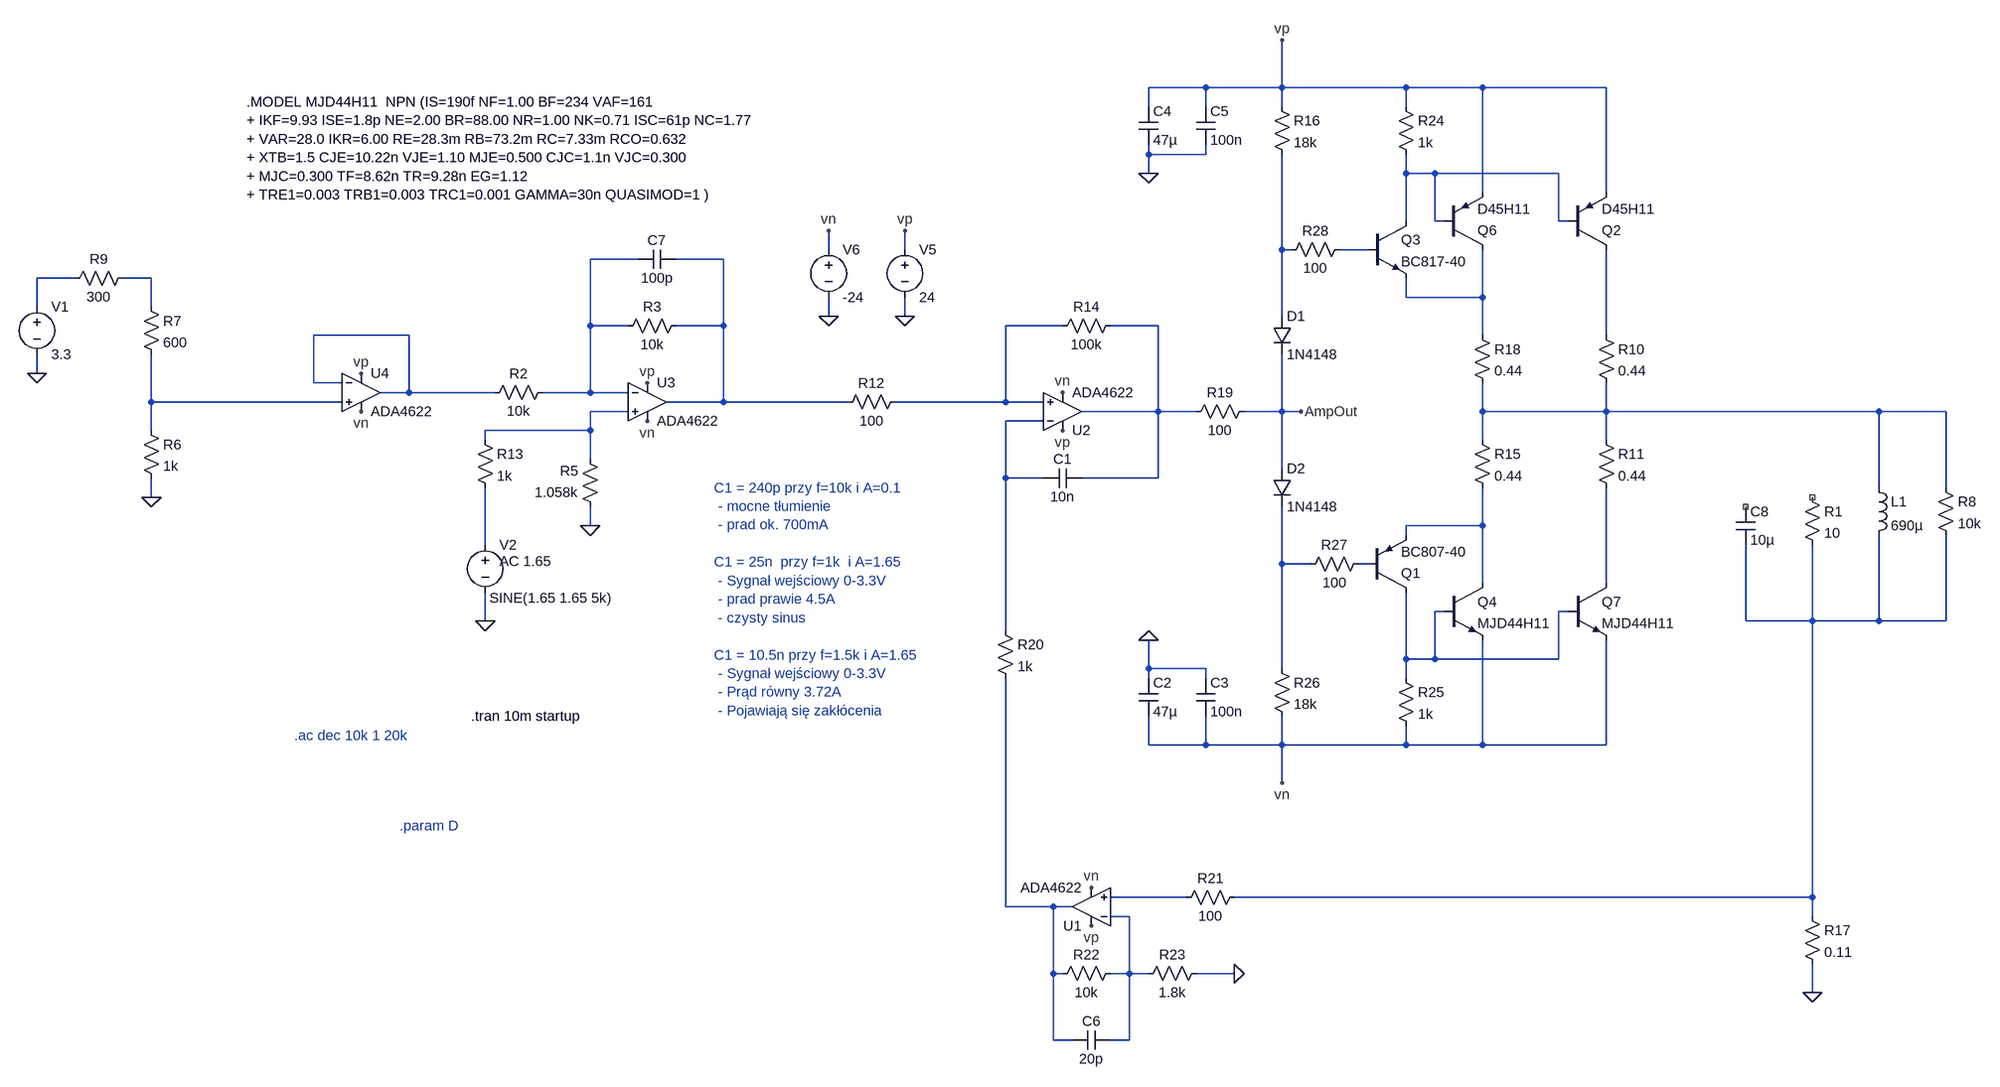
[diagram p0: schematic Shutter.asc]
Shutter.asc, the LTspice schematic file:
Version 4.1
SHEET 1 3148 1552
WIRE 1392 -400 1296 -400
WIRE 1520 -400 1520 -480
WIRE 1520 -400 1392 -400
WIRE 1728 -400 1520 -400
WIRE 1856 -400 1728 -400
WIRE 2064 -400 1856 -400
WIRE 1296 -368 1296 -400
WIRE 1392 -368 1392 -400
WIRE 1520 -368 1520 -400
WIRE 1728 -368 1728 -400
WIRE 1296 -288 1296 -304
WIRE 1392 -288 1392 -304
WIRE 1392 -288 1296 -288
WIRE 1296 -256 1296 -288
WIRE 1728 -256 1728 -288
WIRE 1776 -256 1728 -256
WIRE 1984 -256 1776 -256
WIRE 1856 -224 1856 -400
WIRE 2064 -224 2064 -400
WIRE 1728 -176 1728 -256
WIRE 1776 -176 1776 -256
WIRE 1792 -176 1776 -176
WIRE 1984 -176 1984 -256
WIRE 2000 -176 1984 -176
WIRE 736 -128 736 -160
WIRE 864 -128 864 -160
WIRE 1520 -128 1520 -288
WIRE 1536 -128 1520 -128
WIRE 1664 -128 1616 -128
WIRE 416 -112 336 -112
WIRE 560 -112 480 -112
WIRE -528 -80 -592 -80
WIRE -400 -80 -448 -80
WIRE 1728 -48 1728 -80
WIRE 1856 -48 1856 -128
WIRE 1856 -48 1728 -48
WIRE -592 -32 -592 -80
WIRE -400 -32 -400 -80
WIRE 736 -16 736 -48
WIRE 864 -16 864 -48
WIRE 1520 -16 1520 -128
WIRE 336 0 336 -112
WIRE 400 0 336 0
WIRE 560 0 560 -112
WIRE 560 0 480 0
WIRE 1152 0 1056 0
WIRE 1312 0 1232 0
WIRE 32 16 -128 16
WIRE 1856 16 1856 -48
WIRE 2064 16 2064 -128
WIRE -592 80 -592 48
WIRE -128 96 -128 16
WIRE -80 96 -128 96
WIRE 32 112 32 16
WIRE 32 112 -16 112
WIRE 176 112 32 112
WIRE 336 112 336 0
WIRE 336 112 256 112
WIRE 400 112 336 112
WIRE -400 128 -400 48
WIRE -80 128 -400 128
WIRE 560 128 560 0
WIRE 560 128 464 128
WIRE 768 128 560 128
WIRE 1056 128 1056 0
WIRE 1056 128 848 128
WIRE 1120 128 1056 128
WIRE 400 144 336 144
WIRE 1312 144 1312 0
WIRE 1312 144 1184 144
WIRE 1376 144 1312 144
WIRE 1520 144 1520 48
WIRE 1520 144 1456 144
WIRE 1552 144 1520 144
WIRE 1856 144 1856 96
WIRE 2064 144 2064 96
WIRE 2064 144 1856 144
WIRE 2720 144 2064 144
WIRE 2832 144 2720 144
WIRE 1120 160 1056 160
WIRE -400 176 -400 128
WIRE 336 176 336 144
WIRE 336 176 160 176
WIRE 160 192 160 176
WIRE 1856 192 1856 144
WIRE 2064 192 2064 144
WIRE 336 224 336 176
WIRE 1520 240 1520 144
WIRE 1056 256 1056 160
WIRE 1120 256 1056 256
WIRE 1312 256 1312 144
WIRE 1312 256 1184 256
WIRE 2720 272 2720 144
WIRE 2832 272 2832 144
WIRE -400 288 -400 256
WIRE 336 336 336 304
WIRE 1856 336 1856 272
WIRE 1856 336 1728 336
WIRE 1728 352 1728 336
WIRE 160 368 160 272
WIRE 1520 400 1520 304
WIRE 1568 400 1520 400
WIRE 1664 400 1648 400
WIRE 1856 432 1856 336
WIRE 2064 432 2064 272
WIRE 1792 480 1776 480
WIRE 2000 480 1984 480
WIRE 160 496 160 448
WIRE 2496 496 2496 368
WIRE 2608 496 2608 368
WIRE 2608 496 2496 496
WIRE 2720 496 2720 352
WIRE 2720 496 2608 496
WIRE 2832 496 2832 352
WIRE 2832 496 2720 496
WIRE 1056 512 1056 256
WIRE 1728 560 1728 448
WIRE 1776 560 1776 480
WIRE 1776 560 1728 560
WIRE 1984 560 1984 480
WIRE 1984 560 1776 560
WIRE 1296 576 1296 528
WIRE 1392 576 1296 576
WIRE 1520 576 1520 400
WIRE 1296 592 1296 576
WIRE 1392 592 1392 576
WIRE 1728 592 1728 560
WIRE 1296 704 1296 656
WIRE 1392 704 1392 656
WIRE 1392 704 1296 704
WIRE 1520 704 1520 656
WIRE 1520 704 1392 704
WIRE 1728 704 1728 672
WIRE 1728 704 1520 704
WIRE 1856 704 1856 528
WIRE 1856 704 1728 704
WIRE 2064 704 2064 528
WIRE 2064 704 1856 704
WIRE 1520 768 1520 704
WIRE 1360 960 1232 960
WIRE 2608 960 2608 496
WIRE 2608 960 1440 960
WIRE 1056 976 1056 592
WIRE 1136 976 1056 976
WIRE 1168 976 1136 976
WIRE 1264 992 1232 992
WIRE 2608 992 2608 960
WIRE 1136 1088 1136 976
WIRE 1152 1088 1136 1088
WIRE 1264 1088 1264 992
WIRE 1264 1088 1232 1088
WIRE 1296 1088 1264 1088
WIRE 1440 1088 1376 1088
WIRE 2608 1120 2608 1072
WIRE 1136 1200 1136 1088
WIRE 1168 1200 1136 1200
WIRE 1264 1200 1264 1088
WIRE 1264 1200 1232 1200
FLAG 864 -160 vp
FLAG 1296 528 0
FLAG 1296 -256 0
FLAG 2608 1120 0
FLAG 736 -160 vn
FLAG 864 -16 0
FLAG 736 -16 0
FLAG 1152 112 vn
FLAG 1152 176 vp
FLAG 1200 944 vn
FLAG 1200 1008 vp
FLAG 1520 -480 vp
FLAG 1520 768 vn
FLAG 432 160 vn
FLAG 432 96 vp
FLAG 160 496 0
FLAG -400 288 0
FLAG -592 80 0
FLAG 1552 144 AmpOut
FLAG 1440 1088 0
FLAG 336 336 0
FLAG -48 144 vn
FLAG -48 80 vp
SYMBOL voltage 864 -144 R0
WINDOW 123 0 0 Left 0
WINDOW 39 0 0 Left 0
SYMATTR InstName V5
SYMATTR Value 24
SYMBOL voltage 736 -144 R0
WINDOW 123 0 0 Left 0
WINDOW 39 0 0 Left 0
SYMATTR InstName V6
SYMATTR Value -24
SYMBOL res 1248 -16 R90
WINDOW 0 0 56 VBottom 2
WINDOW 3 32 56 VTop 2
SYMATTR InstName R14
SYMATTR Value 100k
SYMBOL cap 1184 240 R90
WINDOW 0 0 32 VBottom 2
WINDOW 3 32 32 VTop 2
SYMATTR InstName C1
SYMATTR Value 10n
SYMBOL res 1840 176 R0
SYMATTR InstName R15
SYMATTR Value 0.44
SYMBOL cap 1280 592 R0
SYMATTR InstName C2
SYMATTR Value 47µ
SYMBOL cap 1376 592 R0
SYMATTR InstName C3
SYMATTR Value 100n
SYMBOL cap 1280 -368 R0
SYMATTR InstName C4
SYMATTR Value 47µ
SYMBOL cap 1376 -368 R0
SYMATTR InstName C5
SYMATTR Value 100n
SYMBOL res 1504 -384 R0
SYMATTR InstName R16
SYMATTR Value 18k
SYMBOL res 2592 976 R0
SYMATTR InstName R17
SYMATTR Value 0.11
SYMBOL res 1840 0 R0
SYMATTR InstName R18
SYMATTR Value 0.44
SYMBOL diode 1504 -16 R0
SYMATTR InstName D1
SYMATTR Value 1N4148
SYMBOL res 1472 128 R90
WINDOW 0 0 56 VBottom 2
WINDOW 3 32 56 VTop 2
SYMATTR InstName R19
SYMATTR Value 100
SYMBOL res 1040 496 R0
SYMATTR InstName R20
SYMATTR Value 1k
SYMBOL res 1456 944 R90
WINDOW 0 0 56 VBottom 2
WINDOW 3 32 56 VTop 2
SYMATTR InstName R21
SYMATTR Value 100
SYMBOL res 1248 1072 R90
WINDOW 0 0 56 VBottom 2
WINDOW 3 32 56 VTop 2
SYMATTR InstName R22
SYMATTR Value 10k
SYMBOL res 1392 1072 R90
WINDOW 0 0 56 VBottom 2
WINDOW 3 32 56 VTop 2
SYMATTR InstName R23
SYMATTR Value 1.8k
SYMBOL diode 1504 240 R0
SYMATTR InstName D2
SYMATTR Value 1N4148
SYMBOL npn 1664 -176 R0
SYMATTR InstName Q3
SYMATTR Value BC817-40
SYMBOL res 1712 -384 R0
SYMATTR InstName R24
SYMATTR Value 1k
SYMBOL res 1712 576 R0
SYMATTR InstName R25
SYMATTR Value 1k
SYMBOL res 1504 560 R0
SYMATTR InstName R26
SYMATTR Value 18k
SYMBOL res 1664 384 R90
WINDOW 0 0 56 VBottom 2
WINDOW 3 32 56 VTop 2
SYMATTR InstName R27
SYMATTR Value 100
SYMBOL res 1632 -144 R90
WINDOW 0 0 56 VBottom 2
WINDOW 3 32 56 VTop 2
SYMATTR InstName R28
SYMATTR Value 100
SYMBOL voltage 160 352 R0
WINDOW 123 24 44 Left 2
WINDOW 39 0 0 Left 0
WINDOW 3 7 105 Left 2
SYMATTR Value2 AC 1.65
SYMATTR Value SINE(1.65 1.65 5k)
SYMATTR InstName V2
SYMBOL res 496 -16 R90
WINDOW 0 0 56 VBottom 2
WINDOW 3 32 56 VTop 2
SYMATTR InstName R3
SYMATTR Value 10k
SYMBOL res 272 96 R90
WINDOW 0 0 56 VBottom 2
WINDOW 3 32 56 VTop 2
SYMATTR InstName R2
SYMATTR Value 10k
SYMBOL res -416 160 R0
SYMATTR InstName R6
SYMATTR Value 1k
SYMBOL res -416 -48 R0
SYMATTR InstName R7
SYMATTR Value 600
SYMBOL voltage -592 -48 R0
WINDOW 123 0 0 Left 0
WINDOW 39 0 0 Left 0
SYMATTR InstName V1
SYMATTR Value 3.3
SYMBOL cap 480 -128 R90
WINDOW 0 0 32 VBottom 2
WINDOW 3 32 32 VTop 2
SYMATTR InstName C7
SYMATTR Value 100p
SYMBOL res -432 -96 R90
WINDOW 0 0 56 VBottom 2
WINDOW 3 32 56 VTop 2
SYMATTR InstName R9
SYMATTR Value 300
SYMBOL cap 1232 1184 R90
WINDOW 0 0 32 VBottom 2
WINDOW 3 32 32 VTop 2
SYMATTR InstName C6
SYMATTR Value 20p
SYMBOL res 2816 256 R0
SYMATTR InstName R8
SYMATTR Value 10k
SYMBOL ind 2704 256 R0
SYMATTR InstName L1
SYMATTR Value 690µ
SYMATTR SpiceLine Ipk=4 Rser=2
SYMBOL res 352 320 R180
WINDOW 0 36 76 Left 2
WINDOW 3 36 40 Left 2
SYMATTR InstName R5
SYMATTR Value 1.058k
SYMBOL Opamps\\ADA4622 1200 1040 R180
SYMATTR InstName U1
SYMBOL Opamps\\ADA4622 1152 208 M180
SYMATTR InstName U2
SYMBOL Opamps\\ADA4622 432 64 R0
SYMATTR InstName U3
SYMBOL pnp 1792 -128 M180
SYMATTR InstName Q6
SYMATTR Value D45H11
SYMBOL pnp 1664 448 M180
SYMATTR InstName Q1
SYMATTR Value BC807-40
SYMBOL pnp 2000 -128 M180
SYMATTR InstName Q2
SYMATTR Value D45H11
SYMBOL res 2048 0 R0
SYMATTR InstName R10
SYMATTR Value 0.44
SYMBOL res 2048 176 R0
SYMATTR InstName R11
SYMATTR Value 0.44
SYMBOL res 144 176 R0
SYMATTR InstName R13
SYMATTR Value 1k
SYMBOL res 864 112 R90
WINDOW 0 0 56 VBottom 2
WINDOW 3 32 56 VTop 2
SYMATTR InstName R12
SYMATTR Value 100
SYMBOL npn 2000 432 R0
SYMATTR InstName Q7
SYMATTR Value MJD44H11
SYMBOL npn 1792 432 R0
SYMATTR InstName Q4
SYMATTR Value MJD44H11
SYMBOL res 2592 272 R0
SYMATTR InstName R1
SYMATTR Value 10
SYMBOL cap 2480 304 R0
SYMATTR InstName C8
SYMATTR Value 10µ
SYMBOL Opamps\\ADA4622 -48 48 R0
SYMATTR InstName U4
TEXT 136 656 Left 2 !.tran 10m startup
TEXT 16 840 Left 2 ;.param D
TEXT 544 272 Left 2 ;C1 = 240p przy f=10k i A=0.1\n - mocne tłumienie\n - prad ok. 700mA\n \nC1 = 25n  przy f=1k  i A=1.65\n - Sygnał wejściowy 0-3.3V \n - prad prawie 4.5A\n - czysty sinus\n \nC1 = 10.5n przy f=1.5k i A=1.65\n - Sygnał wejściowy 0-3.3V\n - Prąd równy 3.72A\n - Pojawiają się zakłócenia
TEXT -240 -376 Left 2 !.MODEL MJD44H11  NPN (IS=190f NF=1.00 BF=234 VAF=161\n+ IKF=9.93 ISE=1.8p NE=2.00 BR=88.00 NR=1.00 NK=0.71 ISC=61p NC=1.77\n+ VAR=28.0 IKR=6.00 RE=28.3m RB=73.2m RC=7.33m RCO=0.632\n+ XTB=1.5 CJE=10.22n VJE=1.10 MJE=0.500 CJC=1.1n VJC=0.300\n+ MJC=0.300 TF=8.62n TR=9.28n EG=1.12\n+ TRE1=0.003 TRB1=0.003 TRC1=0.001 GAMMA=30n QUASIMOD=1 )
TEXT -160 688 Left 2 ;.ac dec 10k 1 20k

The netlist it stands for:
* Shutter.asc
V5 vp 0 24
V6 vn 0 -24
R14 N010 N009 100k
C1 N010 N016 10n
R15 N015 N017 0.44
C2 0 vn 47µ
C3 0 vn 100n
C4 vp 0 47µ
C5 vp 0 100n
R16 vp N002 18k
R17 N023 0 0.11
R18 N008 N015 0.44
D1 N002 AmpOut 1N4148
R19 AmpOut N010 100
R20 N016 N025 1k
R21 N023 N024 100
R22 N026 N025 10k
R23 0 N026 1.8k
D2 AmpOut N019 1N4148
Q3 N001 N003 N008 0 BC817-40
R24 vp N001 1k
R25 N022 vn 1k
R26 N019 vn 18k
R27 N020 N019 100
R28 N003 N002 100
V2 N018 0 SINE(1.65 1.65 5k) AC 1.65
R3 N005 N004 10k
R2 N004 N011 10k
R6 N013 0 1k
R7 N007 N013 600
V1 N006 0 3.3
C7 N005 N004 100p
R9 N007 N006 300
C6 N026 N025 20p
R8 N015 N023 10k
L1 N015 N023 690µ Ipk=4 Rser=2
R5 0 N014 1.058k
X§U1 N024 N026 vp vn N025 ADA4622  ; pins In+ In- V+ V- OUT
X§U2 N009 N016 vp vn N010 ADA4622  ; pins In+ In- V+ V- OUT
X§U3 N014 N004 vp vn N005 ADA4622  ; pins In+ In- V+ V- OUT
Q6 N008 N001 vp 0 D45H11
Q1 N022 N020 N017 0 BC807-40
Q2 N012 N001 vp 0 D45H11
R10 N012 N015 0.44
R11 N015 N021 0.44
R13 N014 N018 1k
R12 N009 N005 100
Q7 N021 N022 vn 0 MJD44H11
Q4 N017 N022 vn 0 MJD44H11
R1 NC_01 N023 10
C8 NC_02 N023 10µ
X§U4 N013 N011 vp vn N011 ADA4622  ; pins In+ In- V+ V- OUT
.model D D
.lib standard.dio
.model NPN NPN
.model PNP PNP
.lib standard.bjt
.tran 10m startup
* .param D
* C1 = 240p przy f=10k i A=0.1
*  - mocne tłumienie
*  - prad ok. 700mA
* C1 = 25n  przy f=1k  i A=1.65
*  - Sygnał wejściowy 0-3.3V
*  - prad prawie 4.5A
*  - czysty sinus
* C1 = 10.5n przy f=1.5k i A=1.65
*  - Sygnał wejściowy 0-3.3V
*  - Prąd równy 3.72A
*  - Pojawiają się zakłócenia
.MODEL MJD44H11  NPN (IS=190f NF=1.00 BF=234 VAF=161
+ IKF=9.93 ISE=1.8p NE=2.00 BR=88.00 NR=1.00 NK=0.71 ISC=61p NC=1.77
+ VAR=28.0 IKR=6.00 RE=28.3m RB=73.2m RC=7.33m RCO=0.632
+ XTB=1.5 CJE=10.22n VJE=1.10 MJE=0.500 CJC=1.1n VJC=0.300
+ MJC=0.300 TF=8.62n TR=9.28n EG=1.12
+ TRE1=0.003 TRB1=0.003 TRC1=0.001 GAMMA=30n QUASIMOD=1 )
* .ac dec 10k 1 20k
.lib ADA4622.lib
.backanno
.end